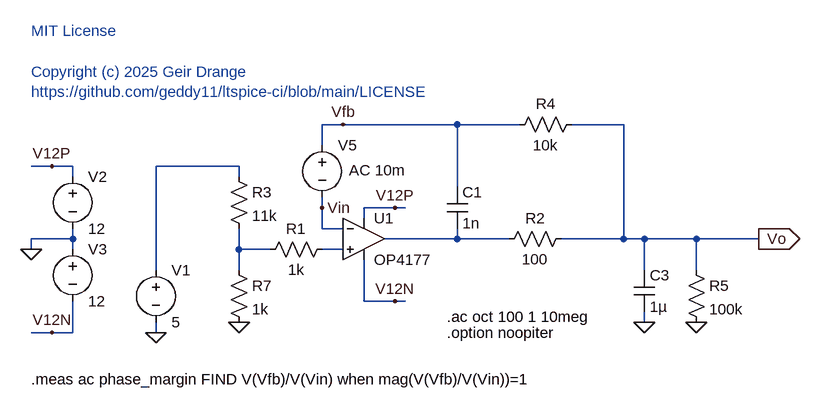
[diagram p0: schematic opamp_open_loop.asc]
opamp_open_loop.asc, the LTspice schematic file:
Version 4
SHEET 1 5952 680
WIRE 208 -32 176 -32
WIRE 384 -32 208 -32
WIRE 480 -32 384 -32
WIRE 640 -32 560 -32
WIRE 176 0 176 -32
WIRE -240 32 -272 32
WIRE -208 32 -240 32
WIRE 48 32 -80 32
WIRE -208 48 -208 32
WIRE 48 48 48 32
WIRE 384 64 384 -32
WIRE 176 96 176 80
WIRE 288 96 240 96
WIRE 304 96 288 96
WIRE 240 112 240 96
WIRE 176 128 176 96
WIRE 208 128 176 128
WIRE -208 144 -208 128
WIRE -208 144 -272 144
WIRE 384 144 384 128
WIRE 384 144 272 144
WIRE 464 144 384 144
WIRE 640 144 640 -32
WIRE 640 144 544 144
WIRE 672 144 640 144
WIRE 752 144 672 144
WIRE 848 144 752 144
WIRE -272 160 -272 144
WIRE -208 160 -208 144
WIRE 48 160 48 128
WIRE 96 160 48 160
WIRE 208 160 176 160
WIRE -80 192 -80 32
WIRE 48 192 48 160
WIRE 672 192 672 144
WIRE 752 192 752 144
WIRE 240 240 240 176
WIRE 288 240 240 240
WIRE 304 240 288 240
WIRE 672 272 672 256
WIRE -240 288 -272 288
WIRE -208 288 -208 240
WIRE -208 288 -240 288
WIRE -80 288 -80 272
FLAG 288 96 V12P
FLAG -80 288 0
FLAG -272 160 0
FLAG -240 32 V12P
FLAG -240 288 V12N
FLAG 288 240 V12N
FLAG 672 272 0
FLAG 848 144 Vo
IOPIN 848 144 Out
FLAG 176 96 Vin
FLAG 48 272 0
FLAG 208 -32 Vfb
FLAG 752 272 0
SYMBOL Opamps\\OP4177 240 80 R0
SYMATTR InstName U1
SYMBOL res 192 144 R90
WINDOW 0 0 56 VBottom 2
WINDOW 3 32 56 VTop 2
SYMATTR InstName R1
SYMATTR Value 1k
SYMBOL voltage -80 176 R0
WINDOW 123 0 0 Left 0
WINDOW 39 0 0 Left 0
SYMATTR InstName V1
SYMATTR Value 5
SYMBOL voltage -208 32 R0
WINDOW 123 0 0 Left 0
WINDOW 39 0 0 Left 0
SYMATTR InstName V2
SYMATTR Value 12
SYMBOL voltage -208 144 R0
WINDOW 123 0 0 Left 0
WINDOW 39 0 0 Left 0
SYMATTR InstName V3
SYMATTR Value 12
SYMBOL res 560 128 R90
WINDOW 0 0 56 VBottom 2
WINDOW 3 32 56 VTop 2
SYMATTR InstName R2
SYMATTR Value 100
SYMBOL cap 368 64 R0
SYMATTR InstName C1
SYMATTR Value 1n
SYMBOL res 576 -48 R90
WINDOW 0 0 56 VBottom 2
WINDOW 3 32 56 VTop 2
SYMATTR InstName R4
SYMATTR Value 10k
SYMBOL cap 656 192 R0
SYMATTR InstName C3
SYMATTR Value 1µ
SYMBOL res 32 176 R0
SYMATTR InstName R7
SYMATTR Value 1k
SYMBOL res 32 32 R0
SYMATTR InstName R3
SYMATTR Value 11k
SYMBOL voltage 176 -16 R0
WINDOW 123 41 54 Left 2
WINDOW 39 0 0 Left 0
SYMATTR Value2 AC 10m
SYMATTR InstName V5
SYMATTR Value ""
SYMBOL res 736 176 R0
SYMATTR InstName R5
SYMATTR Value 100k
TEXT 368 264 Left 2 !.ac oct 100 1 10meg
TEXT -272 360 Left 2 !.meas ac phase_margin FIND V(Vfb)/V(Vin) when mag(V(Vfb)/V(Vin))=1
TEXT -272 -176 Left 2 ;MIT License\n \nCopyright (c) 2025 Geir Drange\nhttps://github.com/geddy11/ltspice-ci/blob/main/LICENSE
TEXT 368 288 Left 2 !.option noopiter

The netlist it stands for:
* opamp_open_loop.asc
XU1 N004 Vin V12P V12N N002 OP4177  ; pins In+ In- V+ V- OUT
R1 N004 N003 1k
V1 N001 0 5
V2 V12P 0 12
V3 0 V12N 12
R2 Vo N002 100
C1 Vfb N002 1n
R4 Vo Vfb 10k
C3 Vo 0 1µ
R7 N003 0 1k
R3 N001 N003 11k
V5 Vfb Vin AC 10m
R5 Vo 0 100k
.ac oct 100 1 10meg
.meas ac phase_margin FIND V(Vfb)/V(Vin) when mag(V(Vfb)/V(Vin))=1
* MIT License
* Copyright (c) 2025 Geir Drange
* https://github.com/geddy11/ltspice-ci/blob/main/LICENSE
.option noopiter
.backanno
.end